# Altium schematic sheet Control.SchDoc
size A4
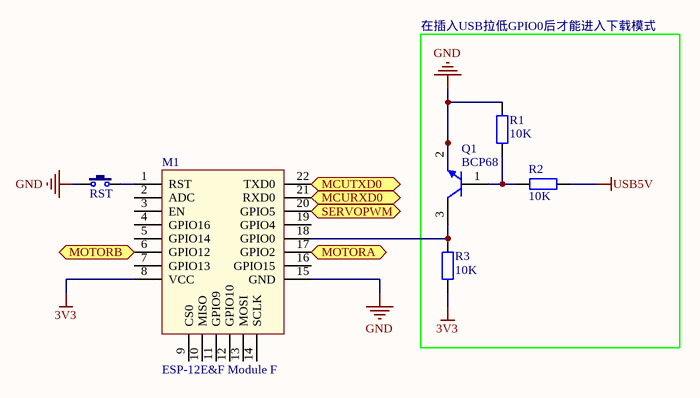
[diagram p0: Control.SchDoc]

## Parts
M1  ESP-12E&F Module F  [ESP-12E&F Module]
Q1  BCP68  [SOT-23]
R1  10K  [R 0805_L]
R2  10K  [R 0805_L]
R3  10K  [R 0805_L]
RST  3x6x5  [TSW SMD-3*6*2.5]  (value not drawn)

## Blocks framed on the sheet
在插入USB拉低GPIO0后才能进入下载模式: Q1 R1-R3

## Ports
MCURXD0 (bidir), MCUTXD0 (bidir), MOTORA (bidir), MOTORB (bidir), SERVOPWM (bidir)

## Nets
3V3: M1.8(VCC) R3.1
GND: M1.15(GND) Q1.2(E) R1.2 RST.1
USB5V: R2.2
MCURXD0: M1.21(RXD0) ; port MCURXD0
MCUTXD0: M1.22(TXD0) ; port MCUTXD0
MOTORA: M1.17(GPIO2) ; port MOTORA
MOTORB: M1.6(GPIO12) ; port MOTORB
SERVOPWM: M1.20(GPIO5) ; port SERVOPWM
NetM1_1: M1.1(RST) RST.2
NetM1_18: M1.18(GPIO0) Q1.3(C) R3.2
NetQ1_1: Q1.1(B) R1.1 R2.1

Not connected (* = marked no-connect by the designer): M1 2(ADC) 3(EN) 4(GPIO16) 5(GPIO14) 7(GPIO13) 9(CS0) 10(MISO) 11(GPIO9) 12(GPIO10) 13(MOSI) 14(SCLK) 16(GPIO15) 19(GPIO4)

## Library data of the parts
M1 = ESP-12E&F Module
Q1 = BCP68: NPN三极管; Published: 17-Sep-2003; LatestRevisionDate: 12-Dec-2006; LatestRevisionNote: IPC-7351 Footprint Added.; DatasheetVersion: 8-Apr-1999; PackageVersion: Aug-2001; PackageReference: SOT223; Publisher: Altium Limited; PackageDescription: 4-Pin SOT-223 Package 2.3 mm Pitch, 7 mm Lead Span; ComponentLink1Description: Manufacturer Link; ComponentLink1URL: http://www.semiconductors.philips.com/; ComponentLink2Description: Datasheet; ComponentLink2URL: http://www.semiconductors.philips.com/acrobat/datasheets/BCP68_4.pdf
R1-R3 = R: 贴片电阻; 版权归属: 来自淘宝 ID：黄晶宝石; 封装库来自淘宝卖家 ID：黄晶宝石: 其他店铺购入均为盗版，不享受售后技术支持服务，请立即申请退款; BOM名称: 贴片电阻; 联系售后: https://shop463601444.taobao.com
RST = TSW 3x6: 3x6轻触开关; 版权归属: 封装库来自淘宝 ID：黄晶宝石; BOM名称: 3x6轻触开关; 学习资源: https://shop463601444.taobao.com